# Altium schematic sheet DDR.SchDoc
size 294 x 241 mm; SheetNumber: 2; SheetTotal: 4
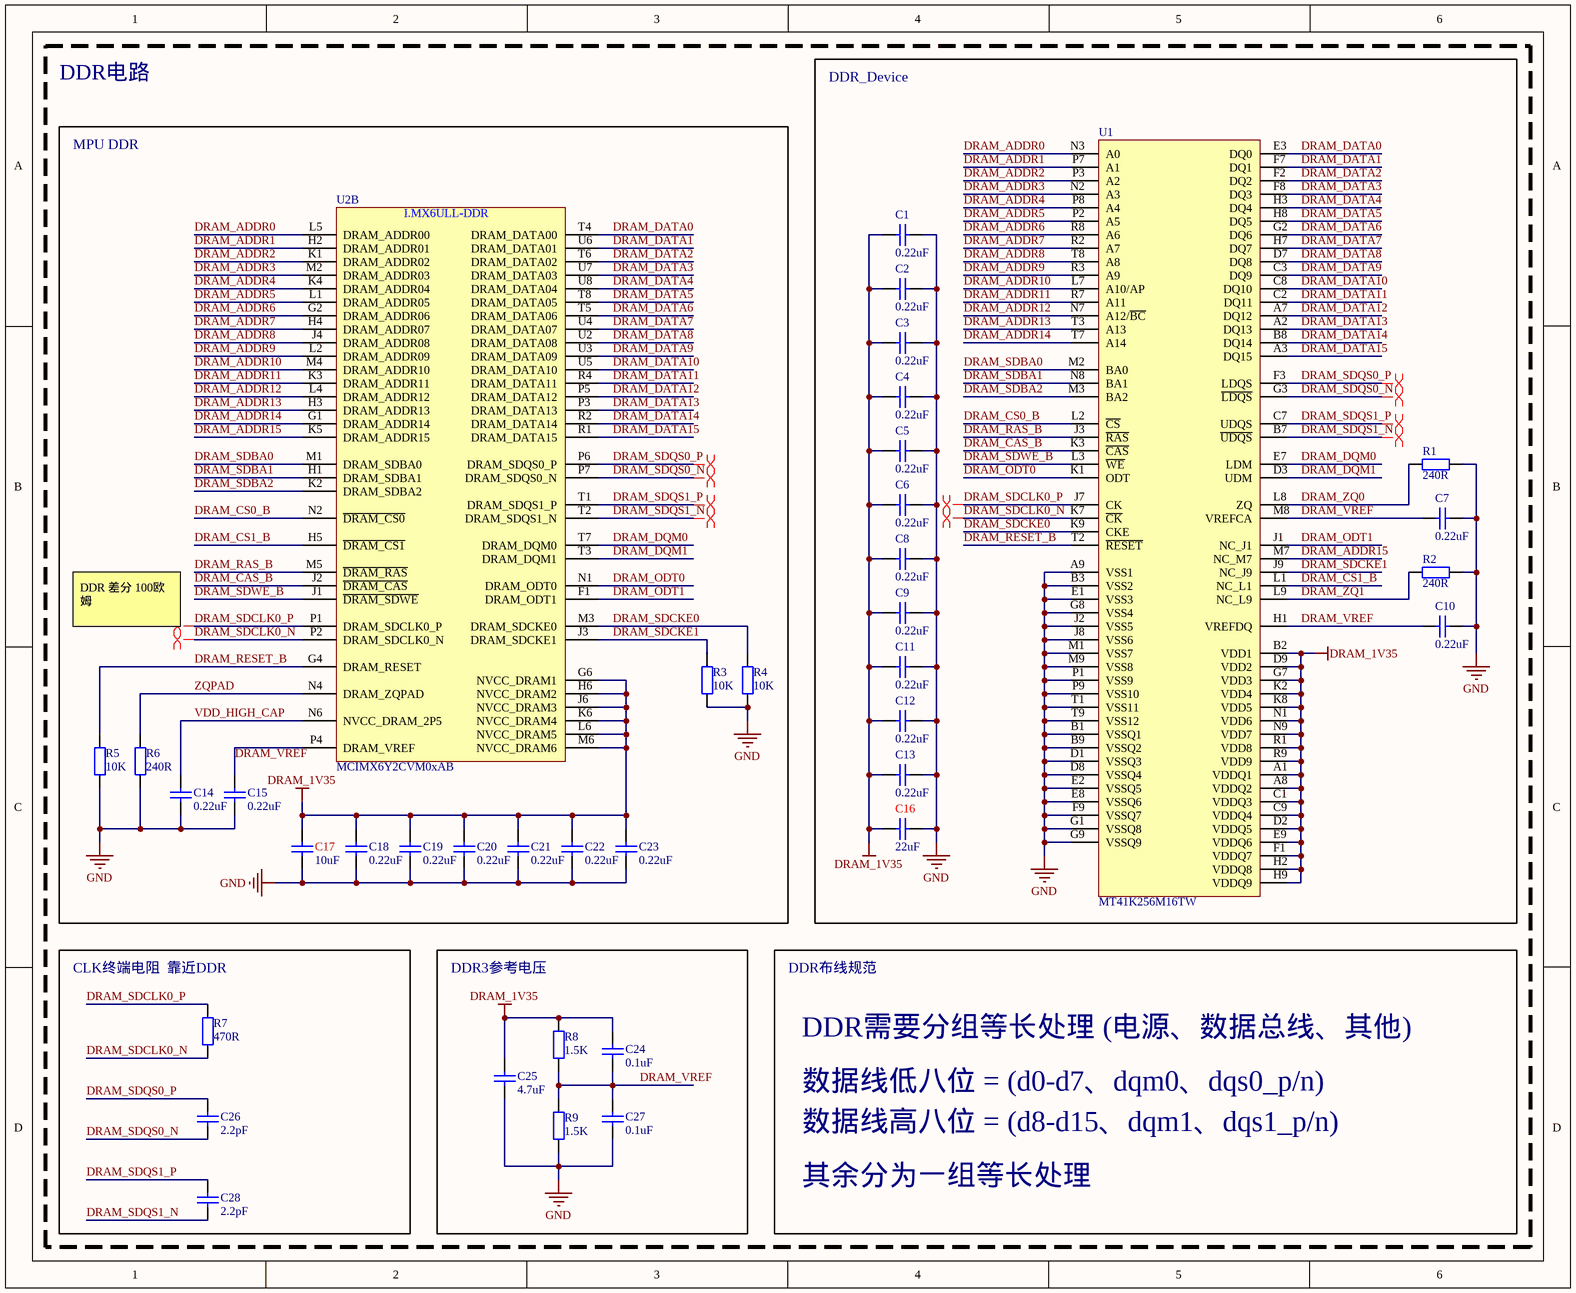
[diagram p0: DDR.SchDoc]

## Parts
C1  0.22uF  [0402_C]
C2  0.22uF  [0402_C]
C3  0.22uF  [0402_C]
C4  0.22uF  [0402_C]
C5  0.22uF  [0402_C]
C6  0.22uF  [0402_C]
C7  0.22uF  [0402_C]
C8  0.22uF  [0402_C]
C9  0.22uF  [0402_C]
C10  0.22uF  [0402_C]
C11  0.22uF  [0402_C]
C12  0.22uF  [0402_C]
C13  0.22uF  [0402_C]
C14  0.22uF  [0402_C]
C15  0.22uF  [0402_C]
C16  22uF  [0603_C _MINI]
C17  10uF  [0603_C _MINI]
C18  0.22uF  [0402_C]
C19  0.22uF  [0402_C]
C20  0.22uF  [0402_C]
C21  0.22uF  [0402_C]
C22  0.22uF  [0402_C]
C23  0.22uF  [0402_C]
C24  0.1uF  [0402_C]
C25  4.7uF  [0402_C]
C26  2.2pF  [0402_C]
C27  0.1uF  [0402_C]
C28  2.2pF  [0402_C]
R1  240R  [0402_R]
R2  240R  [0402_R]
R3  10K  [0402_R]
R4  10K  [0402_R]
R5  10K  [0402_R]
R6  240R  [0402_R]
R7  470R  [0402_R]
R8  1.5K  [0402_R]
R9  1.5K  [0402_R]
U1  MT41K256M16TW  [BGA96]
U2  MCIMX6Y2CVM0xAB  [BGA289_17x17_0.8Pitch]  (part B of 5)

## Blocks framed on the sheet
DDR_Device: C1-C13 C16 R1 R2 U1
MPU DDR: C14 C15 C17-C23 R3-R6 U2
CLK终端电阻  靠近DDR: C26 C28 R7
DDR3参考电压: C24 C25 C27 R8 R9

## Nets
DRAM_1V35: C1.2 C2.2 C3.2 C4.2 C5.2 C6.2 C8.2 C9.2 C11.2 C12.2 C13.2 C16.1 C17.2 C18.2 C19.2 C20.2 C21.2 C22.2 C23.2 C24.2 C25.2 R8.2 U1.A1(VDDQ1) U1.A8(VDDQ2) U1.B2(VDD1) U1.C1(VDDQ3) U1.C9(VDDQ4) U1.D2(VDDQ5) U1.D9(VDD2) U1.E9(VDDQ6) U1.F1(VDDQ7) U1.G7(VDD3) U1.H2(VDDQ8) U1.H9(VDDQ9) U1.K2(VDD4) U1.K8(VDD5) U1.N1(VDD6) U1.N9(VDD7) U1.R1(VDD8) U1.R9(VDD9) U2.G6(NVCC_DRAM1) U2.H6(NVCC_DRAM2) U2.J6(NVCC_DRAM3) U2.K6(NVCC_DRAM4) U2.L6(NVCC_DRAM5) U2.M6(NVCC_DRAM6)
GND: C1.1 C2.1 C3.1 C4.1 C5.1 C6.1 C7.2 C8.1 C9.1 C10.2 C11.1 C12.1 C13.1 C14.1 C15.1 C16.2 C17.1 C18.1 C19.1 C20.1 C21.1 C22.1 C23.1 C25.1 C27.1 R1.1 R2.1 R3.1 R4.1 R5.1 R6.1 R9.1 U1.A9(VSS1) U1.B1(VSSQ1) U1.B3(VSS2) U1.B9(VSSQ2) U1.D1(VSSQ3) U1.D8(VSSQ4) U1.E1(VSS3) U1.E2(VSSQ5) U1.E8(VSSQ6) U1.F9(VSSQ7) U1.G1(VSSQ8) U1.G8(VSS4) U1.G9(VSSQ9) U1.J2(VSS5) U1.J8(VSS6) U1.M1(VSS7) U1.M9(VSS8) U1.P1(VSS9) U1.P9(VSS10) U1.T1(VSS11) U1.T9(VSS12)
DRAM_ADDR0: U1.N3(A0) U2.L5(DRAM_ADDR00)
DRAM_ADDR1: U1.P7(A1) U2.H2(DRAM_ADDR01)
DRAM_ADDR2: U1.P3(A2) U2.K1(DRAM_ADDR02)
DRAM_ADDR3: U1.N2(A3) U2.M2(DRAM_ADDR03)
DRAM_ADDR4: U1.P8(A4) U2.K4(DRAM_ADDR04)
DRAM_ADDR5: U1.P2(A5) U2.L1(DRAM_ADDR05)
DRAM_ADDR6: U1.R8(A6) U2.G2(DRAM_ADDR06)
DRAM_ADDR7: U1.R2(A7) U2.H4(DRAM_ADDR07)
DRAM_ADDR8: U1.T8(A8) U2.J4(DRAM_ADDR08)
DRAM_ADDR9: U1.R3(A9) U2.L2(DRAM_ADDR09)
DRAM_ADDR10: U1.L7(A10/AP) U2.M4(DRAM_ADDR10)
DRAM_ADDR11: U1.R7(A11) U2.K3(DRAM_ADDR11)
DRAM_ADDR12: U1.N7(A12/~{BC}) U2.L4(DRAM_ADDR12)
DRAM_ADDR13: U1.T3(A13) U2.H3(DRAM_ADDR13)
DRAM_ADDR14: U1.T7(A14) U2.G1(DRAM_ADDR14)
DRAM_ADDR15: U1.M7(NC_M7) U2.K5(DRAM_ADDR15)
DRAM_CAS_B: U1.K3(~{CAS}) U2.J2(~{DRAM_CAS})
DRAM_CS0_B: U1.L2(~{CS}) U2.N2(~{DRAM_CS0})
DRAM_CS1_B: U1.L1(NC_L1) U2.H5(~{DRAM_CS1})
DRAM_DATA0: U1.E3(DQ0) U2.T4(DRAM_DATA00)
DRAM_DATA1: U1.F7(DQ1) U2.U6(DRAM_DATA01)
DRAM_DATA2: U1.F2(DQ2) U2.T6(DRAM_DATA02)
DRAM_DATA3: U1.F8(DQ3) U2.U7(DRAM_DATA03)
DRAM_DATA4: U1.H3(DQ4) U2.U8(DRAM_DATA04)
DRAM_DATA5: U1.H8(DQ5) U2.T8(DRAM_DATA05)
DRAM_DATA6: U1.G2(DQ6) U2.T5(DRAM_DATA06)
DRAM_DATA7: U1.H7(DQ7) U2.U4(DRAM_DATA07)
DRAM_DATA8: U1.D7(DQ8) U2.U2(DRAM_DATA08)
DRAM_DATA9: U1.C3(DQ9) U2.U3(DRAM_DATA09)
DRAM_DATA10: U1.C8(DQ10) U2.U5(DRAM_DATA10)
DRAM_DATA11: U1.C2(DQ11) U2.R4(DRAM_DATA11)
DRAM_DATA12: U1.A7(DQ12) U2.P5(DRAM_DATA12)
DRAM_DATA13: U1.A2(DQ13) U2.P3(DRAM_DATA13)
DRAM_DATA14: U1.B8(DQ14) U2.R2(DRAM_DATA14)
DRAM_DATA15: U1.A3(DQ15) U2.R1(DRAM_DATA15)
DRAM_DQM0: U1.E7(LDM) U2.T7(DRAM_DQM0)
DRAM_DQM1: U1.D3(UDM) U2.T3(DRAM_DQM1)
DRAM_ODT0: U1.K1(ODT) U2.N1(DRAM_ODT0)
DRAM_ODT1: U1.J1(NC_J1) U2.F1(DRAM_ODT1)
DRAM_RAS_B: U1.J3(~{RAS}) U2.M5(~{DRAM_RAS})
DRAM_RESET_B: R5.2 U1.T2(~{RESET}) U2.G4(DRAM_RESET)
DRAM_SDBA0: U1.M2(BA0) U2.M1(DRAM_SDBA0)
DRAM_SDBA1: U1.N8(BA1) U2.H1(DRAM_SDBA1)
DRAM_SDBA2: U1.M3(BA2) U2.K2(DRAM_SDBA2)
DRAM_SDCKE0: R4.2 U1.K9(CKE) U2.M3(DRAM_SDCKE0)
DRAM_SDCKE1: R3.2 U1.J9(NC_J9) U2.J3(DRAM_SDCKE1)
DRAM_SDCLK0_N: R7.1 U1.K7(~{CK}) U2.P2(DRAM_SDCLK0_N)
DRAM_SDCLK0_P: R7.2 U1.J7(CK) U2.P1(DRAM_SDCLK0_P)
DRAM_SDQS0_N: C26.1 U1.G3(~{LDQS}) U2.P7(DRAM_SDQS0_N)
DRAM_SDQS0_P: C26.2 U1.F3(LDQS) U2.P6(DRAM_SDQS0_P)
DRAM_SDQS1_N: C28.1 U1.B7(~{UDQS}) U2.T2(DRAM_SDQS1_N)
DRAM_SDQS1_P: C28.2 U1.C7(UDQS) U2.T1(DRAM_SDQS1_P)
DRAM_SDWE_B: U1.L3(~{WE}) U2.J1(~{DRAM_SDWE})
DRAM_VREF: C7.1 C10.1 C15.2 C24.1 C27.2 R8.1 R9.2 U1.H1(VREFDQ) U1.M8(VREFCA) U2.P4(DRAM_VREF)
DRAM_ZQ0: R1.2 U1.L8(ZQ)
DRAM_ZQ1: R2.2 U1.L9(NC_L9)
VDD_HIGH_CAP: C14.2 U2.N6(NVCC_DRAM_2P5)
ZQPAD: R6.2 U2.N4(DRAM_ZQPAD)

## Layout directives
differential pair: DRAM_SDCLK0_N, DRAM_SDCLK0_P, DRAM_SDQS0_N, DRAM_SDQS0_P, DRAM_SDQS1_N, DRAM_SDQS1_P

## Notes on the sheet
- DDR电路
- DDR 差分 100欧姆
- DDR布线规范
- DDR需要分组等长处理 (电源、数据总线、其他)
- 数据线低八位 = (d0-d7、dqm0、dqs0_p/n)
- 数据线高八位 = (d8-d15、dqm1、dqs1_p/n)
- 其余分为一组等长处理
- (in symbol MCIMX6Y2CVM0xAB, part B) I.MX6ULL-DDR

## Library data of the parts
C1-C15 C18-C28 = 0402_C: 贴片电容; ComponentLink1Description: 供应商链接; ComponentLink1URL: http://www.szlcsc.com/product/details_1928.html; Package: 0402; Supplier: LC; SuppliersPartNumber: C1576
C16 C17 = 0603_C_MINI: 贴片电容; ComponentLink1Description: 供应商链接; ComponentLink1URL: http://www.szlcsc.com/product/details_2037.html; Package: 0603; Supplier: LC; SuppliersPartNumber: C1685
R1-R9 = 0402_R: 贴片电阻; ComponentLink1Description: 供应商链接; ComponentLink1URL: http://www.szlcsc.com/product/details_26667.html; Package: 0402; Supplier: LC; SuppliersPartNumber: C25924